# EAGLE schematic that2180 vca new (EAGLE 7.7.0)
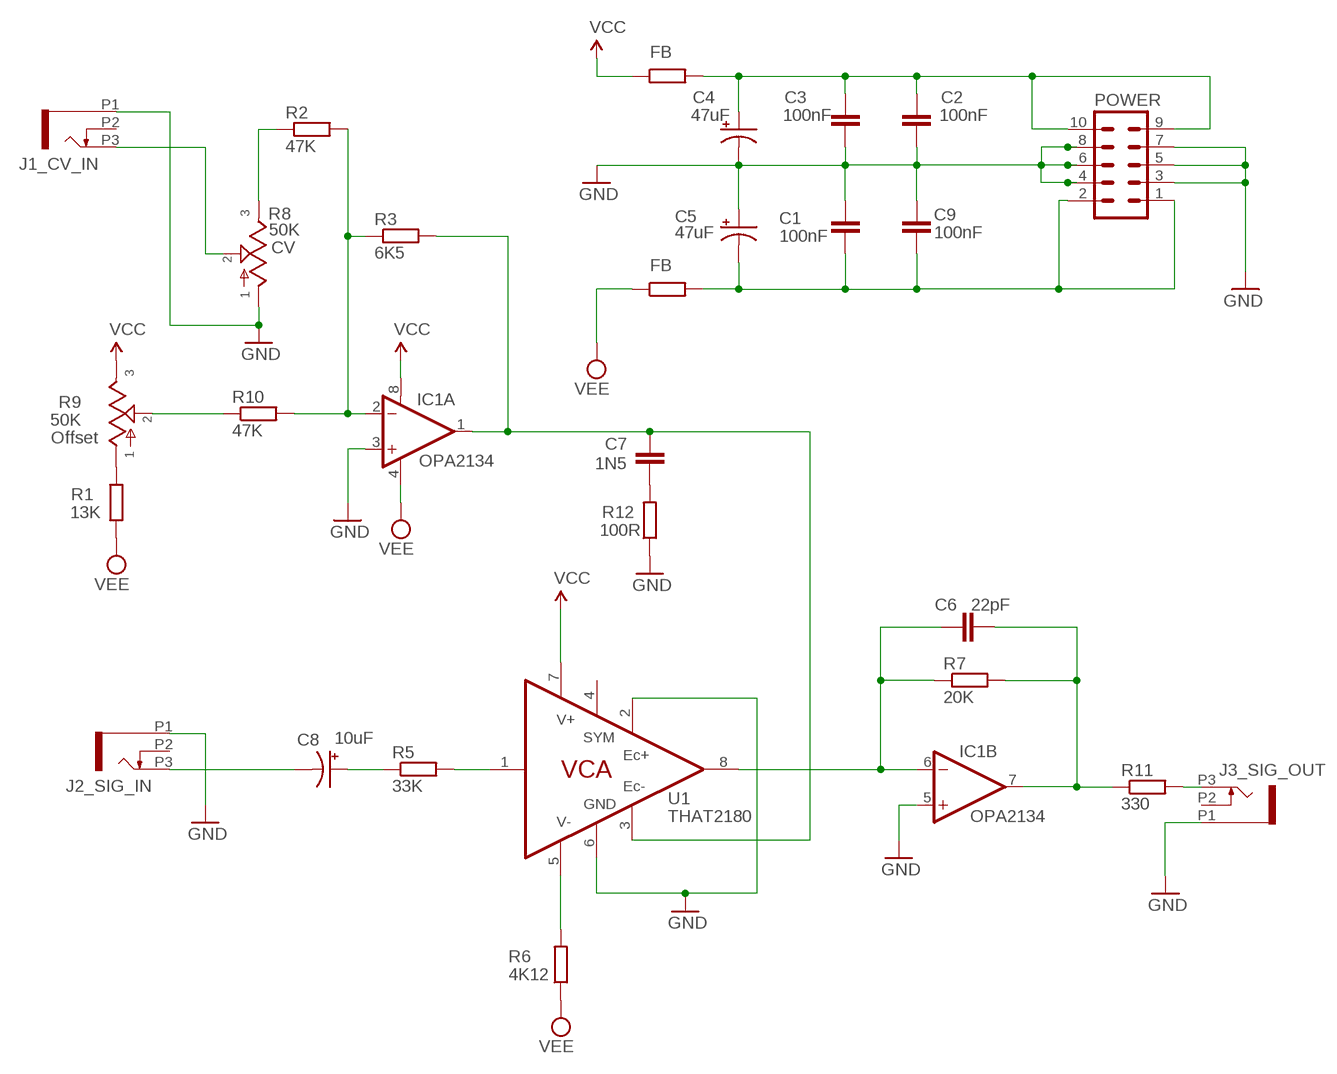
[diagram p0: schematic, sheet 1]

## Parts
C1  100nF  C-EU050-025X075  [C050-025X075]
C2  100nF  C-EU050-025X075  [C050-025X075]
C3  100nF  C-EU050-025X075  [C050-025X075]
C4  47uF  CPOL-USE2.5-5  [E2,5-5]
C5  47uF  CPOL-USE2.5-5  [E2,5-5]
C6  22pF  C-EU050-025X075  [C050-025X075]
C7  1N5  C-EU050-025X075  [C050-025X075]
C8  10uF  CPOL-USE2.5-5  [E2,5-5]
C9  100nF  C-EU050-025X075  [C050-025X075]
IC1  OPAMP-DUALDIP  [DIP08]
J1_CV_IN  PJ301_THONKICONN6  [WQP_PJ_301M6]
J2_SIG_IN  PJ301_THONKICONN6  [WQP_PJ_301M6]
J3_SIG_OUT  PJ301_THONKICONN6  [WQP_PJ_301M6]
POWER  ML10  [ML10]
R1  13K  R-EU_0207/10  [0207/10]
R2  47K  R-EU_0207/10  [0207/10]
R3  6K5  R-EU_0207/10  [0207/10]
R4  FB  R-EU_0207/10  [0207/10]
R5  33K  R-EU_0207/10  [0207/10]
R6  4K12  R-EU_0207/10  [0207/10]
R7  20K  R-EU_0207/10  [0207/10]
R8  50K  POTPOT  [16MM-PCB-MOUNT]
R9  50K  POTPOT  [16MM-PCB-MOUNT]
R10  47K  R-EU_0207/10  [0207/10]
R11  330  R-EU_0207/10  [0207/10]
R12  100R  R-EU_0207/10  [0207/10]
R13  FB  R-EU_0207/10  [0207/10]
U1  THAT2180  [SIP8]

## Nets
GND: C1.2 C2.1 C3.1 C4.- C5.+ C9.2 IC1.3(A:+IN) IC1.5(B:+IN) J1_CV_IN.P1 J2_SIG_IN.P1 J3_SIG_OUT.P1 POWER.3 POWER.4 POWER.5 POWER.6 POWER.7 POWER.8 R8.1 R12.1 U1.2(EC+) U1.6(GND)
N$1: J1_CV_IN.P3 R8.2
N$2: C7.2 IC1.1(A:OUT) R3.2 U1.3(EC-)
N$3: R2.1 R8.3
N$4: IC1.2(A:-IN) R2.2 R3.1 R10.2
N$5: R5.2 U1.1(IN)
N$6: C8.- J2_SIG_IN.P3
N$7: C8.+ R5.1
N$8: C6.1 IC1.6(B:-IN) R7.1 U1.8(OUT)
N$10: R6.2 U1.5(V-)
N$11: C6.2 IC1.7(B:OUT) R7.2 R11.1
N$12: R1.2 R9.1
N$13: C7.1 R12.2
N$14: R9.2 R10.1
N$15: J3_SIG_OUT.P3 R11.2
VCC: C2.2 C3.2 C4.+ IC1.8(A:V+) POWER.9 POWER.10 R4.1 R4.2 R9.3 U1.7(V+)
VEE: C1.1 C5.- C9.1 IC1.4(A:V-) POWER.1 POWER.2 R1.1 R6.1 R13.1 R13.2
Unconnected: J1_CV_IN.P2 J2_SIG_IN.P2 J3_SIG_OUT.P2 U1.4(SYM)

## Notes on the sheet
- FB
- CV
- FB
- Offset
- OPA2134
- OPA2134

## Library data of the parts
C1-C3 C6 C7 C9 = rcl:C-EU: CAPACITOR, European symbol
C4 C5 C8 = rcl:CPOL-US: POLARIZED CAPACITOR, American symbol
IC1 = SparkFun-AnalogIC:OPAMP-DUAL: Generic op-amp footprint
J1_CV_IN J2_SIG_IN J3_SIG_OUT = og-pj301:PJ301_THONKICONN
POWER = con-ml:ML10: HARTING; OC_FARNELL: unknown; OC_NEWARK: unknown
R1-R7 R10-R13 = rcl:R-EU_: RESISTOR, European symbol
R8 R9 = gm-pots:POT: Potentiometers the arrow indicates the clockwise motion of th wiper (lug 2) fully counter clockwise there is no resistance between lugs 1 and 2 fully clockwise the resistance between lugs 1 and 2 is the value of the pot
U1 = that-corp:THAT2180: VCA Trimmable IC